# EAGLE schematic Autodesk Nano Card Schematic (EAGLE 9.7.0)
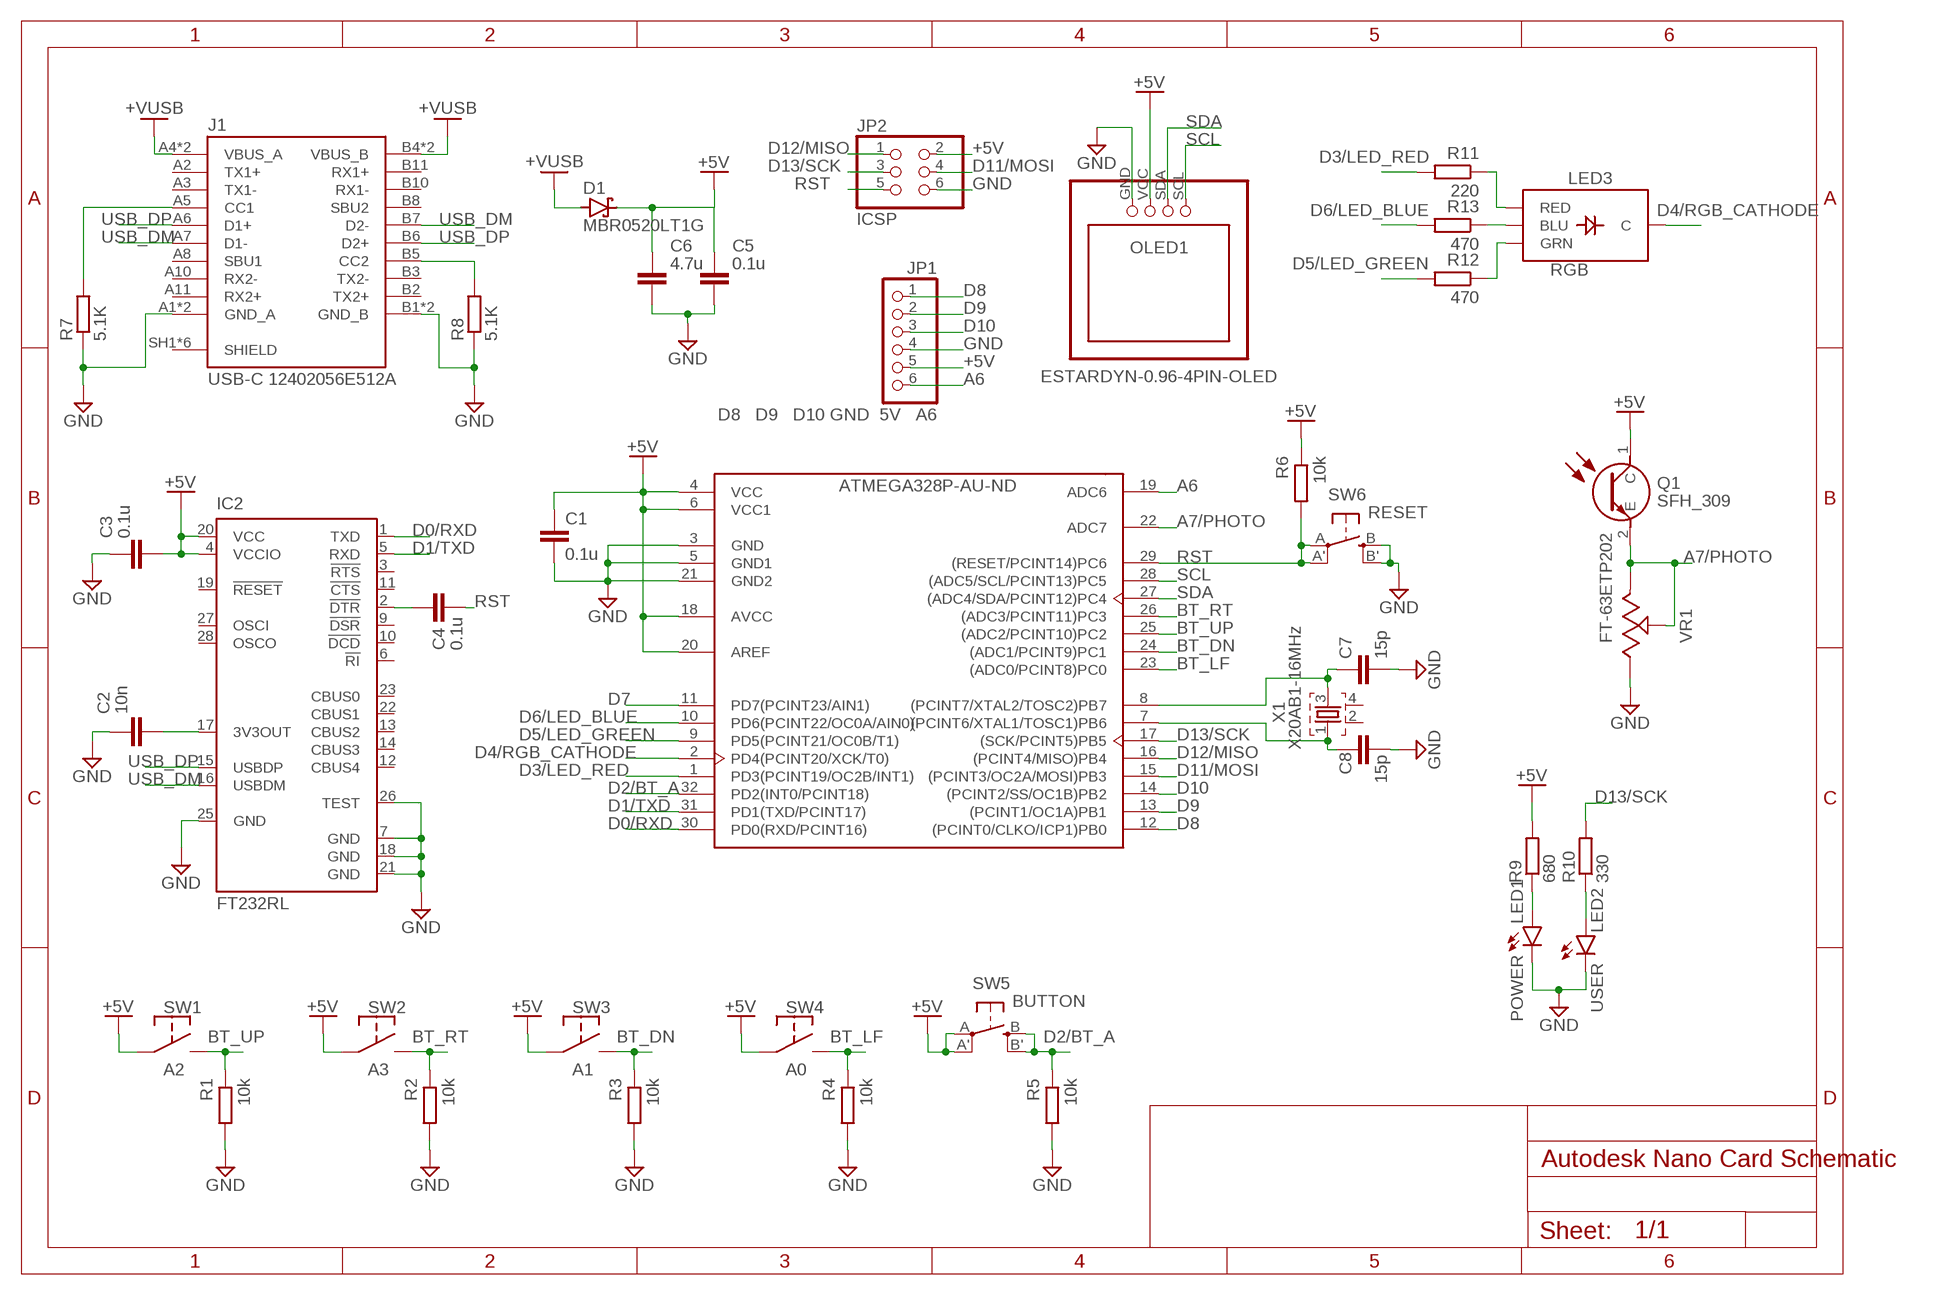
[diagram p0: schematic, sheet 1]

## Parts
C1  0.1u  C-EUC0805  [C0805]
C2  10n  C-EUC0805  [C0805]
C3  0.1u  C-EUC0805  [C0805]
C4  0.1u  C-EUC0805  [C0805]
C5  0.1u  C-EUC0805  [C0805]
C6  4.7u  C-EUC0805  [C0805]
C7  15p  C-EUC0805  [C0805]
C8  15p  C-EUC0805  [C0805]
D1  MBR0520LT1G  [SOD-123]
IC1  ATMEGA328P-AU  [TQFP-32]
IC2  FT232RL  [SSOP28]
J1  USB-C 12402056E512A  12402056E512A  [AMPHENOL_12402056E512A]
JP1  D8 D9 D10 GND 5V A6  PINHD-1X6/90  [1X06/90]
JP2  ICSP  PINHD-2X3  [2X03]
LED1  POWER  CHIP-FLAT-Y_0805  [LEDC2012X110N_FLAT-Y]
LED2  USER  CHIP-FLAT-Y_0805  [LEDC2012X110N_FLAT-Y]
LED3  RGB  RS-254-5727DIFFUSE  [LED-RGB-THRU]
OLED1  ESTARDYN-0.96-4PIN-OLED  [0.94-4PIN]
Q1  SFH_309  [SFH309]
R1  10k  R-EU_0207/10  [0207/10]
R2  10k  R-EU_0207/10  [0207/10]
R3  10k  R-EU_0207/10  [0207/10]
R4  10k  R-EU_0207/10  [0207/10]
R5  10k  R-EU_R0805  [R0805]
R6  10k  R-EU_R0805  [R0805]
R7  5.1K  R-EU_R0805  [R0805]
R8  5.1K  R-EU_R0805  [R0805]
R9  680  R-EU_R0805  [R0805]
R10  330  R-EU_R0805  [R0805]
R11  220  R-EU_0207/10  [0207/10]
R12  470  R-EU_0207/10  [0207/10]
R13  470  R-EU_0207/10  [0207/10]
SW1  A2  DTS-32N-V-B  [DTS32NVB]
SW2  A3  DTS-32N-V-B  [DTS32NVB]
SW3  A1  DTS-32N-V-B  [DTS32NVB]
SW4  A0  DTS-32N-V-B  [DTS32NVB]
SW5  BUTTON  SPST_TACT-EVQQ2  [EVQ-Q2]
SW6  RESET  SPST_TACT-EVQQ2  [EVQ-Q2]
VR1  FT-63ETP202  FT-63ETP  [FT63ETP]
X1  X20AB1-16MHz  FA-20H  [FA-20H]

## Nets
+5V [Power]: C1.1 C3.1 C5.1 C6.1 D1.C IC1.4(VCC) IC1.6(VCC1) IC1.18(AVCC) IC1.20(AREF) IC2.4(VCCIO) IC2.20(VCC) JP1.5 JP2.2 OLED1.VCC Q1.1(C) R6.1 R9.2 SW1.1(COM) SW2.1(COM) SW3.1(COM) SW4.1(COM) SW5.A'(P1) SW5.A(P)
+VUSB [Power]: D1.A J1.A4(VBUS_A) J1.A9(VBUS_A) J1.B4(VBUS_B) J1.B9(VBUS_B)
A6: IC1.19(ADC6) JP1.6
A7/PHOTO: IC1.22(ADC7) Q1.2(E) VR1.1 VR1.2
BT_DN: IC1.24((ADC1/PCINT9)PC1) R3.1 SW3.2(NO)
BT_LF: IC1.23((ADC0/PCINT8)PC0) R4.1 SW4.2(NO)
BT_RT: IC1.26((ADC3/PCINT11)PC3) R2.1 SW2.2(NO)
BT_UP: IC1.25((ADC2/PCINT10)PC2) R1.1 SW1.2(NO)
CC1: J1.A5(CC1) R7.2
CC2: J1.B5(CC2) R8.2
D0/RXD: IC1.30(PD0(RXD/PCINT16)) IC2.1(TXD)
D1/TXD: IC1.31(PD1(TXD/PCINT17)) IC2.5(RXD)
D2/BT_A: IC1.32(PD2(INT0/PCINT18)) R5.1 SW5.B'(S1) SW5.B(S)
D3/LED_RED: IC1.1(PD3(PCINT19/OC2B/INT1)) R11.2
D4/RGB_CATHODE: IC1.2(PD4(PCINT20/XCK/T0)) LED3.3(C)
D5/LED_GREEN: IC1.9(PD5(PCINT21/OC0B/T1)) R12.2
D6/LED_BLUE: IC1.10(PD6(PCINT22/OC0A/AIN0)) R13.2
D7: IC1.11(PD7(PCINT23/AIN1))
D8: IC1.12((PCINT0/CLKO/ICP1)PB0) JP1.1
D9: IC1.13((PCINT1/OC1A)PB1) JP1.2
D10: IC1.14((PCINT2/SS/OC1B)PB2) JP1.3
D11/MOSI: IC1.15((PCINT3/OC2A/MOSI)PB3) JP2.4
D12/MISO: IC1.16((PCINT4/MISO)PB4) JP2.1
D13/SCK: IC1.17((SCK/PCINT5)PB5) JP2.3 R10.2
DTR: C4.1 IC2.2(!DTR)
GND [Power]: C1.2 C2.1 C3.2 C5.2 C6.2 C7.2 C8.2 IC1.3(GND) IC1.5(GND1) IC1.21(GND2) IC2.7(GND) IC2.18(GND) IC2.21(GND) IC2.25(GND) IC2.26(TEST) J1.A1(GND_A) J1.A12(GND_A) J1.B1(GND_B) J1.B12(GND_B) JP1.4 JP2.6 LED1.C LED2.C OLED1.GND R1.2 R2.2 R3.2 R4.2 R5.2 R7.1 R8.1 SW6.B'(S1) SW6.B(S) VR1.3
N$2: LED3.4(RED) R11.1
N$3: LED1.A R9.1
N$4: C8.1 IC1.7((PCINT6/XTAL1/TOSC1)PB6) X1.1
N$5: C7.1 IC1.8((PCINT7/XTAL2/TOSC2)PB7) X1.3
N$6: LED3.2(BLU) R13.1
N$7: LED3.1(GRN) R12.1
N$8: C2.2 IC2.17(3V3OUT)
N$9: LED2.A R10.1
RST: C4.2 IC1.29((RESET/PCINT14)PC6) JP2.5 R6.2 SW6.A'(P1) SW6.A(P)
SCL: IC1.28((ADC5/SCL/PCINT13)PC5) OLED1.SCL
SDA: IC1.27((ADC4/SDA/PCINT12)PC4) OLED1.SDA
USB_DM: IC2.16(USBDM) J1.A7(D1-) J1.B7(D2-)
USB_DP: IC2.15(USBDP) J1.A6(D1+) J1.B6(D2+)
Unconnected: IC2.3(!RTS) IC2.6(!RI) IC2.9(!DSR) IC2.10(!DCD) IC2.11(!CTS) IC2.12(CBUS4) IC2.13(CBUS2) IC2.14(CBUS3) IC2.19(!RESET) IC2.22(CBUS1) IC2.23(CBUS0) IC2.27(OSCI) IC2.28(OSCO) J1.A2(TX1+) J1.A3(TX1-) J1.A8(SBU1) J1.A10(RX2-) J1.A11(RX2+) J1.B2(TX2+) J1.B3(TX2-) J1.B8(SBU2) J1.B10(RX1-) J1.B11(RX1+) J1.SH1(SHIELD) J1.SH2(SHIELD) J1.SH3(SHIELD) J1.SH4(SHIELD) J1.SH5(SHIELD) J1.SH6(SHIELD) X1.2 X1.4

## Library data of the parts
C1-C8 = rcl:C-EU: CAPACITOR, European symbol; SPICEPREFIX: C
D1 = Diodes:MBR0520LT1G: DIODE SCHOTTKY 20V 500MA SOD123 Manufacturer's datasheet <https://www.onsemi.com/pub/Collateral/MBR0520LT1-D.PDF>; CREATED_BY: PCBLayout.com; DIGIKEY_PART_NUMBER: MBR0520LT1GOSTR-ND; MANUFACTURER: ON Semiconductor; MPN: MBR0520LT1G; PACKAGE: SOD-123
IC1 = Microcontroller:ATMEGA328P-AU: IC MCU 8BIT 32KB FLASH 32TQFP Manufacturer's datasheet <http://ww1.microchip.com/downloads/en/DeviceDoc/ATmega48A-PA-88A-PA-168A-PA-328-P-DS-DS40002061A.pdf>; CREATED_BY: PCBLayout.com; DIGIKEY_PART_NUMBER: ATMEGA328P-AU-ND; MANUFACTURER: Microchip Technology; MPN: ATMEGA328P-AU; PACKAGE: TQFP-32
IC2 = ftdichip:FT232R: Source: http://www.ftdichip.com/Documents/DataSheets/DS_FT232R_v104.pdf; MPN: FT232RL; OC_FARNELL: 1146032; OC_NEWARK: 91K9918
J1 = 12402056E512A:12402056E512A; MANUFACTURER: Amphenol; MAXIMUM_PACKAGE_HEIGHT: 3.43mm; PARTREV: 5; SNAPEDA_PN: 12402056E512A; STANDARD: Manufacturer Recommendations
JP1 = Connector:PINHD-1X6: PIN HEADER; CATEGORY: Headers; DESCRIPTION: Header-Right Angle-6 Position; PACKAGE_TYPE: THT; PITCH: 0.100" (2.54mm); SUBCATEGORY: Headers-Male Pins; TYPE: Board to Board or Cable-Unshrouded-Through Hole-Right Angle
JP2 = Connector:PINHD-2X3: PIN HEADER; CATEGORY: Headers; DESCRIPTION: Header, Straight, 2x3 Position; MANUFACTURER: Generic; MPN: Generic; OPERATING_TEMPERATURE: Generic; PART_STATUS: Active; PITCH: 0.100" (2.54mm); ROHS_COMPLIANCE: Generic; SERIES: Generic; SUB-CATEGORY: Headers, Male Pins; TYPE: Board to Board or Cable, Unshrouded, Through Hole, Straight; VALUE: PINHD-2X3
LED1 LED2 = LED:CHIP-FLAT-Y; CATEGORY: LED; COLOR: YELLOW; DESCRIPTION: CHIP LED FLAT; SUB-CATEGORY: CHIP; TYPE: FLAT_TOP; VALUE: LED_YELLOW
LED3 = DTS-32N-V-B:RS-254-5727: LED-RGB Common Cathode Packages: LED RGB-THRU LED_PIRANHA_5MM SparkFun Products: RGB Diffused Common Cathode- Diffuse <[https://www.sparkfun.com/products/9264]> RGB Diffused Common Cathode - Clear <[https://www.sparkfun.com/products/105]> LED-RGB 5mm Square (Piranha) <[https://www.sparkfun.com/products/11679]>; PROD_ID: DIO-09434; VALUE: DIFFUSE
OLED1 = DTS-32N-V-B:ESTARDYN-0.96-4PIN-OLED
Q1 = DTS-32N-V-B:SFH_309: SFH 309 Osram Opto 24 Full Spectrum Phototransistor, Through Hole 2-Pin 3mm (T-1) package Source: Datasheet <https://dammedia.osram.info/media/resource/hires/osram-dam-5423172/SFH 309_EN.pdf>; DESCRIPTION: SFH 309 Osram Opto 24 Full Spectrum Phototransistor, Through Hole 2-Pin 3mm (T-1) package; HEIGHT: 6.3mm; MANUFACTURER_NAME: ams OSRAM; MANUFACTURER_PART_NUMBER: SFH 309; MOUSER_PART_NUMBER: 720-SFH309; MOUSER_PRICE-STOCK: https://www.mouser.co.uk/ProductDetail/ams-OSRAM/SFH-309?qs=nTDll3UaDK7IiBI7L0xvOA%3D%3D
R1-R13 = rcl:R-EU_: RESISTOR, European symbol; SPICEPREFIX: R
SW1-SW4 = DTS-32N-V-B:DTS-32N-V-B: 3.5mm 5mm Rectangle button 50mA Direct Insert 6mm SPST 12V Plugin Tactile Switches ROHS Source: Datasheet <http://www.dip.com.tw/en/en-product-information/en-switch004/item/download/2482_e206d9b4ca91b6d07db9f3a2c47b5e9a>; DESCRIPTION: 3.5mm 5mm Rectangle button 50mA Direct Insert 6mm SPST 12V Plugin Tactile Switches ROHS; HEIGHT: 5mm; MANUFACTURER_NAME: Diptronics; MANUFACTURER_PART_NUMBER: DTS-32N-V-B; MOUSER_PART_NUMBER: 113-DTS-32N-V-B; MOUSER_PRICE-STOCK: https://www.mouser.co.uk/ProductDetail/Diptronics/DTS-32N-V-B?qs=gTYE2QTfZfRJupfs8INq2A%3D%3D
SW5 SW6 = adafruit:SPST_TACT: SMT 6mm switch, EVQQ2 series http://www.ladyada.net/library/eagle
VR1 = DTS-32N-V-B:FT-63ETP: Trimmer Resistors - Through Hole 10 KW 6mm comm. single turn top adjust on tape Source: Datasheet <https://www.nidec-components.com/e/catalog/trimmer/ft-63.pdf>; DESCRIPTION: Trimmer Resistors - Through Hole 10 KW 6mm comm. single turn top adjust on tape; HEIGHT: 6.1mm; MANUFACTURER_NAME: Nidec Copal; MANUFACTURER_PART_NUMBER: FT-63ETP103; MOUSER_PART_NUMBER: 229-FT-63ETP103; MOUSER_PRICE-STOCK: https://www.mouser.co.uk/ProductDetail/Nidec-Copal/FT-63ETP103?qs=XeJtXLiO41Qx3Me652cD7g%3D%3D
X1 = crystal:FA-: MHz RANGE CRYSTAL UNIT Source: Epson Toyocom